# EAGLE design busadapt (EAGLE 6.6.0)
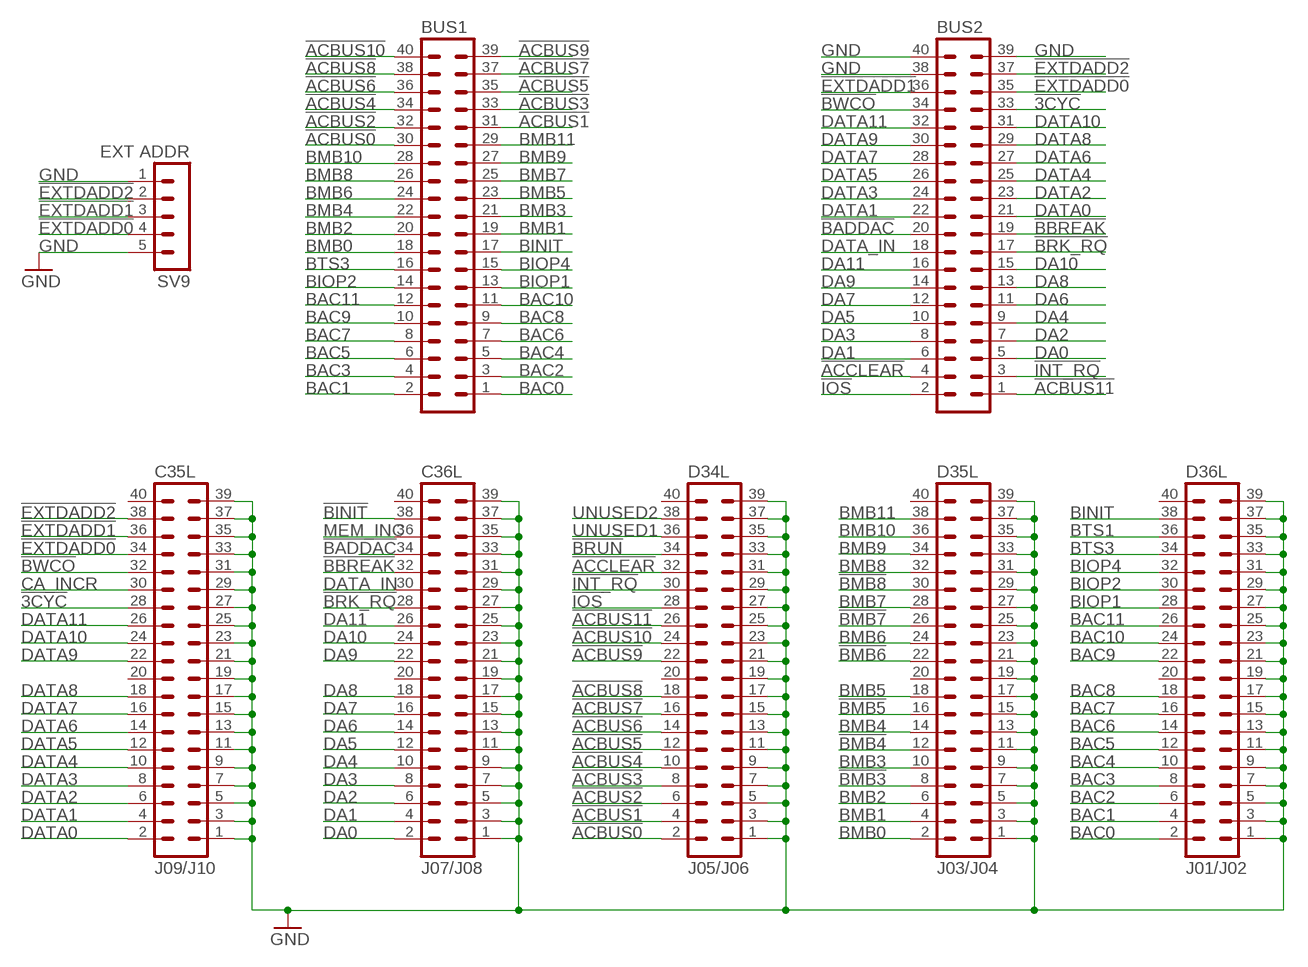
[diagram p0: schematic, sheet 1]

## Parts
BUS1  MA20-2  [MA20-2]
BUS2  MA20-2  [MA20-2]
C35L  J09/J10  MA20-2  [MA20-2]
C36L  J07/J08  MA20-2  [MA20-2]
D34L  J05/J06  MA20-2  [MA20-2]
D35L  J03/J04  MA20-2  [MA20-2]
D36L  J01/J02  MA20-2  [MA20-2]
SV9  EXT ADDR  MA05-1  [MA05-1]

## Nets
!3CYC: BUS2.33 C35L.28
!ACBUS0: BUS1.30 D34L.2
!ACBUS1: BUS1.31 D34L.4
!ACBUS2: BUS1.32 D34L.6
!ACBUS3: BUS1.33 D34L.8
!ACBUS4: BUS1.34 D34L.10
!ACBUS5: BUS1.35 D34L.12
!ACBUS6: BUS1.36 D34L.14
!ACBUS7: BUS1.37 D34L.16
!ACBUS8: BUS1.38 D34L.18
!ACBUS9: BUS1.39 D34L.22
!ACBUS10: BUS1.40 D34L.24
!ACBUS11: BUS2.1 D34L.26
!ACCLEAR: BUS2.4 D34L.32
!BADDAC: BUS2.20 C36L.34
!BBREAK: BUS2.19 C36L.32
!BINIT: C36L.38
!BMB3: D35L.8
!BMB4: D35L.12
!BMB5: D35L.16
!BMB6: D35L.22
!BMB7: D35L.26
!BMB8: D35L.30
!BRK_RQ: BUS2.17 C36L.28
!BRUN: D34L.34
!BWCO: BUS2.34 C35L.32
!EXTDADD0: BUS2.35 C35L.34 SV9.4
!EXTDADD1: BUS2.36 C35L.36 SV9.3
!EXTDADD2: BUS2.37 C35L.38 SV9.2
!INT_RQ: BUS2.3 D34L.30
!IOS: BUS2.2 D34L.28
BAC0: BUS1.1 D36L.2
BAC1: BUS1.2 D36L.4
BAC2: BUS1.3 D36L.6
BAC3: BUS1.4 D36L.8
BAC4: BUS1.5 D36L.10
BAC5: BUS1.6 D36L.12
BAC6: BUS1.7 D36L.14
BAC7: BUS1.8 D36L.16
BAC8: BUS1.9 D36L.18
BAC9: BUS1.10 D36L.22
BAC10: BUS1.11 D36L.24
BAC11: BUS1.12 D36L.26
BINIT: BUS1.17 D36L.38
BIOP1: BUS1.13 D36L.28
BIOP2: BUS1.14 D36L.30
BIOP4: BUS1.15 D36L.32
BMB0: BUS1.18 D35L.2
BMB1: BUS1.19 D35L.4
BMB2: BUS1.20 D35L.6
BMB3: BUS1.21 D35L.10
BMB4: BUS1.22 D35L.14
BMB5: BUS1.23 D35L.18
BMB6: BUS1.24 D35L.24
BMB7: BUS1.25 D35L.28
BMB8: BUS1.26 D35L.32
BMB9: BUS1.27 D35L.34
BMB10: BUS1.28 D35L.36
BMB11: BUS1.29 D35L.38
BTS1: D36L.36
BTS3: BUS1.16 D36L.34
CA_INCR: C35L.30
DA0: BUS2.5 C36L.2
DA1: BUS2.6 C36L.4
DA2: BUS2.7 C36L.6
DA3: BUS2.8 C36L.8
DA4: BUS2.9 C36L.10
DA5: BUS2.10 C36L.12
DA6: BUS2.11 C36L.14
DA7: BUS2.12 C36L.16
DA8: BUS2.13 C36L.18
DA9: BUS2.14 C36L.22
DA10: BUS2.15 C36L.24
DA11: BUS2.16 C36L.26
DATA0: BUS2.21 C35L.2
DATA1: BUS2.22 C35L.4
DATA2: BUS2.23 C35L.6
DATA3: BUS2.24 C35L.8
DATA4: BUS2.25 C35L.10
DATA5: BUS2.26 C35L.12
DATA6: BUS2.27 C35L.14
DATA7: BUS2.28 C35L.16
DATA8: BUS2.29 C35L.18
DATA9: BUS2.30 C35L.22
DATA10: BUS2.31 C35L.24
DATA11: BUS2.32 C35L.26
DATA_IN: BUS2.18 C36L.30
GND: BUS2.38 BUS2.39 BUS2.40 C35L.1 C35L.3 C35L.5 C35L.7 C35L.9 C35L.11 C35L.13 C35L.15 C35L.17 C35L.19 C35L.21 C35L.23 C35L.25 C35L.27 C35L.29 C35L.31 C35L.33 C35L.35 C35L.37 C35L.39 C36L.1 C36L.3 C36L.5 C36L.7 C36L.9 C36L.11 C36L.13 C36L.15 C36L.17 C36L.19 C36L.21 C36L.23 C36L.25 C36L.27 C36L.29 C36L.31 C36L.33 C36L.35 C36L.37 C36L.39 D34L.1 D34L.3 D34L.5 D34L.7 D34L.9 D34L.11 D34L.13 D34L.15 D34L.17 D34L.19 D34L.21 D34L.23 D34L.25 D34L.27 D34L.29 D34L.31 D34L.33 D34L.35 D34L.37 D34L.39 D35L.1 D35L.3 D35L.5 D35L.7 D35L.9 D35L.11 D35L.13 D35L.15 D35L.17 D35L.19 D35L.21 D35L.23 D35L.25 D35L.27 D35L.29 D35L.31 D35L.33 D35L.35 D35L.37 D35L.39 D36L.1 D36L.3 D36L.5 D36L.7 D36L.9 D36L.11 D36L.13 D36L.15 D36L.17 D36L.19 D36L.21 D36L.23 D36L.25 D36L.27 D36L.29 D36L.31 D36L.33 D36L.35 D36L.37 D36L.39 SV9.1 SV9.5
MEM_INC: C36L.36
UNUSED1: D34L.36
UNUSED2: D34L.38
Unconnected: C35L.20 C35L.40 C36L.20 C36L.40 D34L.20 D34L.40 D35L.20 D35L.40 D36L.20 D36L.40

## Library data of the parts
BUS1 BUS2 C35L C36L D34L D35L D36L = con-lstb:MA20-2: PIN HEADER; OC_FARNELL: unknown; OC_NEWARK: unknown
SV9 = con-lstb:MA05-1: PIN HEADER; OC_FARNELL: unknown; OC_NEWARK: unknown

## Board
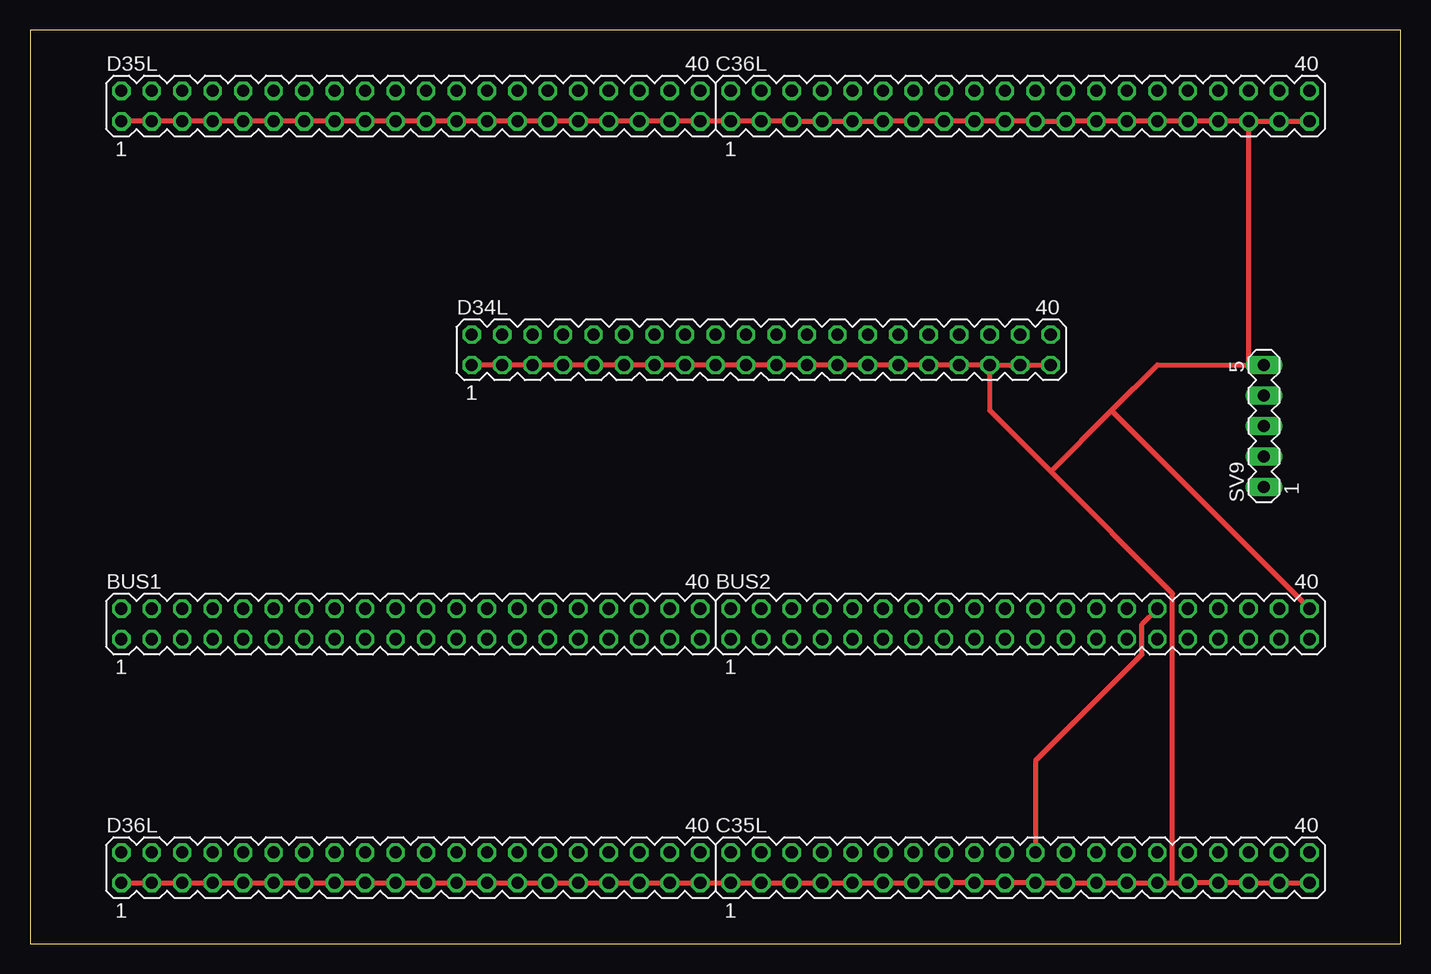
[diagram p1: board, top side]
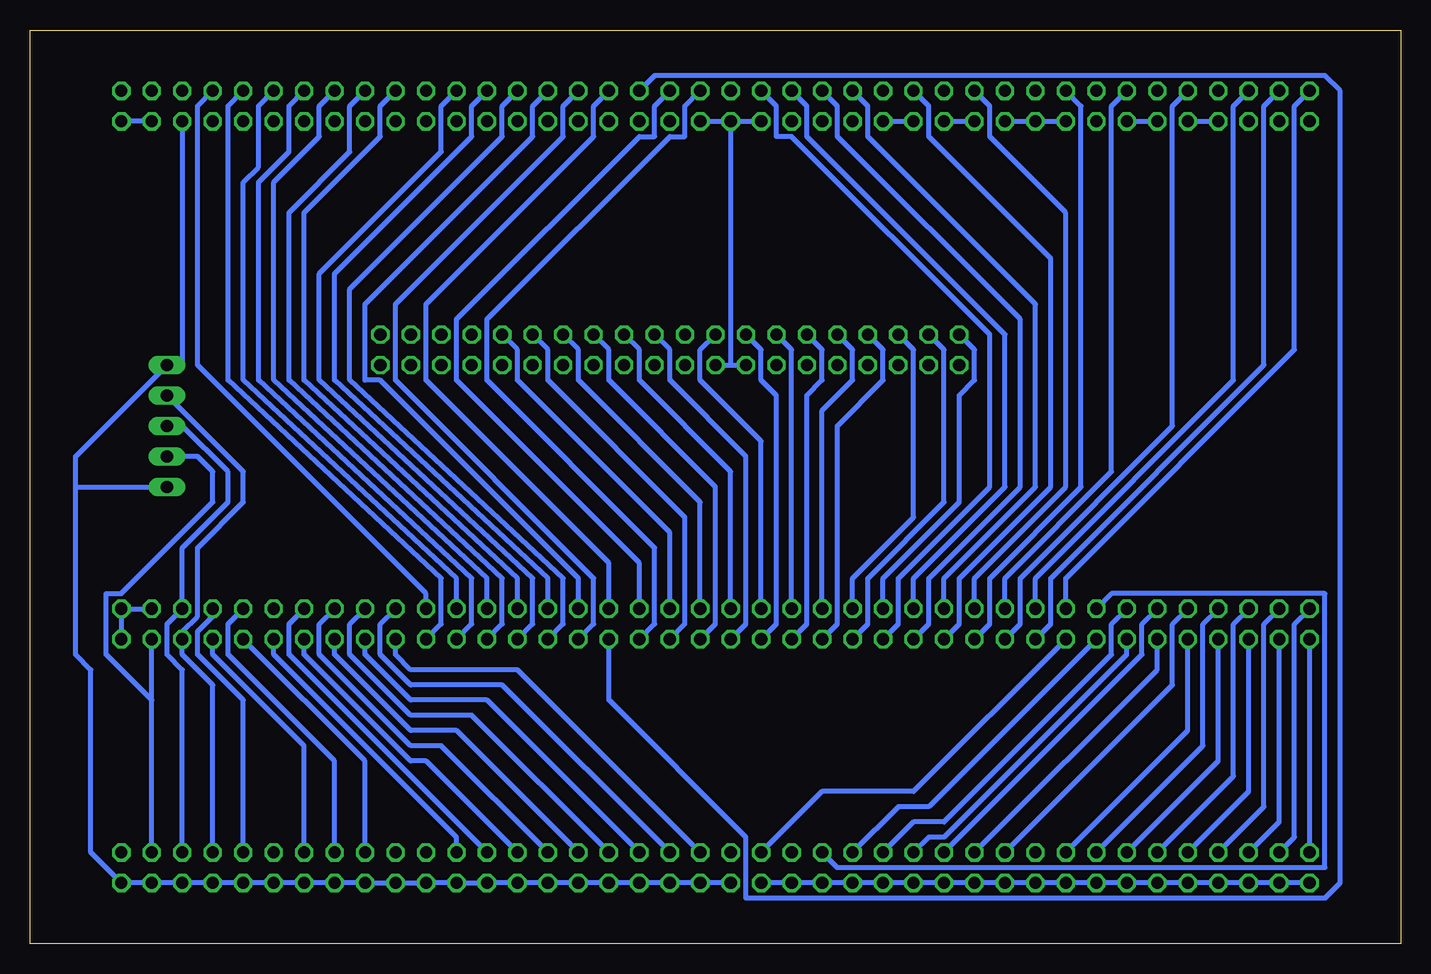
[diagram p2: board, bottom side, seen from below]

Size 114.29 x 76.19 mm. Coordinates in mm from the lower left corner, seen from the top.
Outline: 0,0 114.29,0 114.29,76.19 0,76.19 0,0
Copper layers (1+16): Top 0.035mm / dielectric 1.5mm / Bottom 0.035mm
Design rules "16mils": minimum track width 16mil, minimum drill 32mil, track to track 15mil, track to pad 10mil, pad to pad 10mil, via to via 10mil, smd to smd 10mil, copper to edge 13mil, drill to drill 10mil, minimum pad ring 10mil, minimum via ring 8mil, stop-mask expansion 0mil, vias tented up to drill 0mil, thermal gap 10mil

### Footprints (pad centres in the part's own frame; a part is rotated, then mirrored left to right if it is on the bottom)
MA20-2 = drill 1.016 octagon: 1 -24.13,-1.27; 2 -24.13,1.27; 3 -21.59,-1.27; 4 -21.59,1.27; 5 -19.05,-1.27; 6 -19.05,1.27; 7 -16.51,-1.27; 8 -16.51,1.27; 9 -13.97,-1.27; 10 -13.97,1.27; 11 -11.43,-1.27; 12 -11.43,1.27; 13 -8.89,-1.27; 14 -8.89,1.27; 15 -6.35,-1.27; 16 -6.35,1.27; 17 -3.81,-1.27; 18 -3.81,1.27; 19 -1.27,-1.27; 20 -1.27,1.27; 21 1.27,-1.27; 22 1.27,1.27; 23 3.81,-1.27; 24 3.81,1.27; 25 6.35,-1.27; 26 6.35,1.27; 27 8.89,-1.27; 28 8.89,1.27; 29 11.43,-1.27; 30 11.43,1.27; 31 13.97,-1.27; 32 13.97,1.27; 33 16.51,-1.27; 34 16.51,1.27; 35 19.05,-1.27; 36 19.05,1.27; 37 21.59,-1.27; 38 21.59,1.27; 39 24.13,-1.27; 40 24.13,1.27
MA05-1 = drill 1.016 long: 1 -5.08,0; 2 -2.54,0; 3 0,0; 4 2.54,0; 5 5.08,0

### Placement (x,y rotation side)
BUS1  31.74,26.67 0 top
BUS2  82.54,26.67 0 top
C35L  82.54,6.34 0 top
C36L  82.54,69.84 0 top
D34L  60.95,49.52 0 top
D35L  31.74,69.84 0 top
D36L  31.74,6.34 0 top
SV9  102.86,43.17 90 top

### Tracks (layer width: path | path; a pad name or v marks a point on that pad's centre or on a via)
!3CYC
  Bottom 0.406: C35L.28 91.43,16.51 99.05,24.12 BUS2.33
!ACBUS0
  Bottom 0.406: BUS1.30 43.17,30.48 36.82,36.82 36.82,45.71 35.55,46.98 35.55,49.52 D34L.2
!ACBUS1
  Bottom 0.406: BUS1.31 44.44,26.67 44.44,30.48 38.09,36.82 38.09,49.52 D34L.4
!ACBUS2
  Bottom 0.406: BUS1.32 45.71,30.48 40.63,35.55 40.63,49.52 D34L.6
!ACBUS3
  Bottom 0.406: BUS1.33 46.98,26.67 46.98,43.17 43.17,46.98 43.17,49.52 D34L.8
!ACBUS4
  Bottom 0.406: BUS1.34 48.25,44.45 45.71,46.98 45.71,49.52 D34L.10
!ACBUS5
  Bottom 0.406: BUS1.35 49.52,26.67 49.52,45.71 48.25,46.98 48.25,49.52 D34L.12
!ACBUS6
  Bottom 0.406: BUS1.36 50.79,49.52 D34L.14
!ACBUS7
  Bottom 0.406: BUS1.37 52.06,26.67 52.06,45.71 53.33,46.98 53.33,49.52 D34L.16
!ACBUS8
  Bottom 0.406: BUS1.38 53.33,41.9 58.41,46.98 58.41,49.52 D34L.18
!ACBUS9
  Bottom 0.406: BUS1.39 54.6,26.67 54.6,40.63 60.95,46.98 60.95,49.52 D34L.22
!ACBUS10
  Bottom 0.406: BUS1.40 55.87,39.36 63.49,46.98 63.49,49.52 D34L.24
!ACBUS11
  Bottom 0.406: BUS2.1 57.14,26.67 57.14,38.09 66.03,46.98 66.03,49.52 D34L.26
!ACCLEAR
  Bottom 0.406: BUS2.4 60.95,34.28 73.65,46.98 73.65,49.52 D34L.32
!BADDAC
  Bottom 0.406: C36L.34 100.32,69.84 100.32,48.25 81.27,29.21 BUS2.20
!BBREAK
  Bottom 0.406: BUS2.19 80,26.67 80,30.48 97.78,46.98 97.78,69.84 C36L.32
!BRK_RQ
  Bottom 0.406: BUS2.17 77.46,26.67 77.46,30.48 95.24,46.98 95.24,63.49 92.7,66.04 92.7,69.84 C36L.28
!BWCO
  Bottom 0.406: C35L.32 96.51,20.32 100.32,24.12 100.32,26.03 99.05,27.3 | 99.05,27.3 | 99.05,27.3 BUS2.34
!EXTDADD0
  Bottom 0.406: C35L.34 99.05,21.59 101.59,24.12 BUS2.35 101.59,26.03 100.32,27.3 100.32,33.02 96.51,36.82 96.51,39.36 SV9.4
!EXTDADD1
  Bottom 0.406: C35L.36 101.59,22.86 102.86,24.12 102.86,26.67 BUS2.36 101.59,33.02 99.05,35.55 97.78,36.82 97.78,39.36 101.59,43.17 SV9.3
!EXTDADD2
  Bottom 0.406: 104.13,20.32 BUS2.37 | C35L.38 104.13,20.32 | 104.13,20.32 107.94,24.12 107.94,29.21 106.67,29.21 99.05,36.82 99.05,39.36 100.32,40.63 SV9.2
!INT_RQ
  Bottom 0.406: BUS2.3 59.68,26.67 59.68,35.55 71.11,46.98 71.11,49.52 D34L.30
!IOS
  Bottom 0.406: BUS2.2 58.41,36.82 68.57,46.98 68.57,49.52 D34L.28
BAC0
  Bottom 0.406: D36L.2 BUS1.1
BAC1
  Bottom 0.406: D36L.4 8.88,8.88 8.88,26.67 BUS1.2
BAC2
  Bottom 0.406: D36L.6 10.15,10.15 BUS1.3
BAC3
  Bottom 0.406: BUS1.4 11.42,26.67 11.42,11.42 D36L.8
BAC4
  Bottom 0.406: D36L.10 12.69,12.69 BUS1.5
BAC5
  Bottom 0.406: D36L.12 13.96,13.96 13.96,26.67 BUS1.6
BAC6
  Bottom 0.406: BUS1.7 15.23,15.23 D36L.14
BAC7
  Bottom 0.406: BUS1.8 16.5,26.67 16.5,16.51 D36L.16
BAC8
  Bottom 0.406: BUS1.9 17.77,17.78 D36L.18
BAC9
  Bottom 0.406: D36L.22 19.04,21.59 19.04,26.67 BUS1.10
BAC10
  Bottom 0.406: D36L.24 20.31,22.86 BUS1.11
BAC11
  Bottom 0.406: D36L.26 21.58,24.12 21.58,26.67 BUS1.12
BINIT
  Bottom 0.406: BUS1.17 40.63,12.69 48.25,12.69 D36L.38
BIOP1
  Bottom 0.406: D36L.28 39.36,8.88 38.09,8.88 22.85,24.12 BUS1.13
BIOP2
  Bottom 0.406: BUS1.14 24.12,26.67 24.12,24.12 38.09,10.15 40.63,10.15 D36L.30
BIOP4
  Bottom 0.406: BUS1.15 39.36,11.42 41.9,11.42 D36L.32
BMB0
  Bottom 0.406: BUS1.18 27.93,30.48 8.88,49.52 8.88,69.84 D35L.2
BMB1
  Bottom 0.406: BUS1.19 29.2,26.67 29.2,30.48 11.42,48.25 11.42,69.84 D35L.4
BMB2
  Bottom 0.406: BUS1.20 30.47,30.48 13.96,46.98 13.96,69.84 D35L.6
BMB3
  Bottom 0.406: BUS1.21 31.74,26.67 31.74,30.48 19.04,43.17 19.04,69.84 D35L.10
BMB4
  Bottom 0.406: BUS1.22 33.01,30.48 24.12,39.36 24.12,69.84 D35L.14
BMB5
  Bottom 0.406: BUS1.23 34.28,26.67 34.28,30.48 26.66,38.09 26.66,69.84 D35L.18
BMB6
  Bottom 0.406: BUS1.24 35.55,30.48 27.93,38.09 27.93,60.95 34.28,67.31 34.28,69.84 D35L.24
BMB7
  Bottom 0.406: BUS1.25 36.82,26.67 36.82,30.48 29.2,38.09 29.2,57.14 39.36,67.31 39.36,69.84 D35L.28
BMB8
  Bottom 0.406: BUS1.26 38.09,30.48 30.47,38.09 30.47,53.34 44.44,67.31 44.44,69.84 D35L.32
BMB9
  Bottom 0.406: BUS1.27 39.36,26.67 39.36,30.48 31.74,38.09 31.74,52.06 46.98,67.31 46.98,69.84 D35L.34
BMB10
  Bottom 0.406: BUS1.28 40.63,30.48 33.01,38.09 33.01,50.79 49.52,67.31 49.52,69.84 D35L.36
BMB11
  Bottom 0.406: BUS1.29 41.9,26.67 41.9,30.48 34.28,38.09 34.28,50.79 50.79,67.31 52.06,67.31 52.06,69.84 D35L.38
BTS3
  Bottom 0.406: BUS1.16 24.12,29.21 6.34,29.21 6.34,6.34 46.98,6.34 D36L.34
DA0
  Bottom 0.406: BUS2.5 62.22,26.67 62.22,33.02 76.19,46.98 76.19,52.06 60.95,67.31 59.68,67.31 59.68,69.84 C36L.2
DA1
  Bottom 0.406: BUS2.6 63.49,31.75 78.73,46.98 78.73,52.06 63.49,67.31 62.22,67.31 62.22,69.84 C36L.4
DA2
  Bottom 0.406: BUS2.7 66.03,20.32 54.6,8.88 54.6,3.81 6.34,3.81 5.07,5.08 5.07,71.12 6.34,72.39 62.22,72.39 C36L.6
DA3
  Bottom 0.406: BUS2.8 66.03,31.75 81.27,46.98 81.27,53.34 67.3,67.31 67.3,69.84 C36L.8
DA4
  Bottom 0.406: BUS2.9 67.3,26.67 67.3,30.48 83.81,46.98 83.81,53.34 69.84,67.31 69.84,69.84 C36L.10
DA5
  Bottom 0.406: C36L.12 72.38,69.84 72.38,67.31 86.35,53.34 86.35,46.98 85.08,46.98 68.57,30.48 BUS2.10
DA6
  Bottom 0.406: BUS2.11 69.84,26.67 69.84,30.48 87.62,46.98 87.62,54.6 74.92,67.31 74.92,69.84 C36L.14
DA7
  Bottom 0.406: BUS2.12 71.11,30.48 88.89,46.98 88.89,55.88 77.46,67.31 77.46,69.84 C36L.16
DA8
  Bottom 0.406: BUS2.13 72.38,26.67 72.38,30.48 90.16,46.98 90.16,55.88 80,66.04 80,69.84 C36L.18
DA9
  Bottom 0.406: BUS2.14 73.65,30.48 91.43,46.98 91.43,60.95 85.08,67.31 85.08,69.84 C36L.22
DA10
  Bottom 0.406: BUS2.15 74.92,26.67 74.92,30.48 92.7,46.98 92.7,60.95 87.62,66.04 87.62,69.84 C36L.24
DA11
  Bottom 0.406: BUS2.16 76.19,30.48 93.97,46.98 93.97,63.49 90.16,67.31 90.16,69.84 C36L.26
DATA0
  Bottom 0.406: C35L.2 73.65,22.86 82.54,22.86 83.81,24.12 BUS2.21
DATA1
  Bottom 0.406: C35L.4 74.92,21.59 82.54,21.59 85.08,24.12 85.08,26.67 BUS2.22
DATA2
  Bottom 0.406: C35L.6 76.19,20.32 82.54,20.32 86.35,24.12 BUS2.23
DATA3
  Bottom 0.406: C35L.8 77.46,19.05 82.54,19.05 87.62,24.12 87.62,26.67 BUS2.24
DATA4
  Bottom 0.406: C35L.10 78.73,17.78 82.54,17.78 88.89,24.12 BUS2.25
DATA5
  Bottom 0.406: C35L.12 80,16.51 82.54,16.51 90.16,24.12 90.16,26.67 BUS2.26
DATA6
  Bottom 0.406: C35L.14 81.27,15.23 82.54,15.23 91.43,24.12 BUS2.27
DATA7
  Bottom 0.406: C35L.16 92.7,24.12 92.7,26.67 BUS2.28
DATA8
  Bottom 0.406: C35L.18 78.73,8.88 93.97,24.12 BUS2.29
DATA9
  Top 0.406: 92.7,26.67 92.7,24.12 83.81,15.23 C35L.22 | 92.7,26.67 | 92.7,26.67 BUS2.30 | C35L.22
DATA10
  Bottom 0.406: C35L.24 86.35,15.23 BUS2.31
DATA11
  Bottom 0.406: C35L.26 88.89,15.23 97.78,24.12 97.78,26.67 BUS2.32
DATA_IN
  Bottom 0.406: BUS2.18 78.73,30.48 96.51,46.98 96.51,63.49 95.24,64.77 95.24,69.84 C36L.30
GND
  Top 0.406: D36L.1 D36L.3 D36L.5 D36L.7 D36L.9 D36L.11 D36L.13 D36L.15 D36L.17 D36L.19 D36L.21 D36L.23 D36L.25 D36L.27 D36L.29 D36L.31 D36L.33 D36L.35 D36L.37 D36L.39 C35L.1 C35L.3 C35L.5 C35L.7 C35L.9 C35L.11 C35L.13 C35L.15 C35L.17 C35L.19 C35L.21 C35L.23 C35L.25 C35L.27 C35L.29 95.24,5.08 | 95.24,5.08 C35L.31 C35L.33 C35L.35 C35L.37 C35L.39 | D34L.1 D34L.3 D34L.5 D34L.7 D34L.9 D34L.11 D34L.13 D34L.15 D34L.17 D34L.19 D34L.21 D34L.23 D34L.25 D34L.27 D34L.29 D34L.31 D34L.33 D34L.35 | D34L.35 80,44.45 85.08,39.36 | D34L.35 D34L.37 D34L.39 | 85.08,39.36 95.24,29.21 95.24,5.08 | 85.08,39.36 90.16,44.45 | 90.16,44.45 93.97,48.25 101.59,48.25 | 90.16,44.45 BUS2.40 | D35L.1 D35L.3 D35L.5 D35L.7 D35L.9 D35L.11 D35L.13 D35L.15 D35L.17 D35L.19 D35L.21 D35L.23 D35L.25 D35L.27 D35L.29 D35L.31 D35L.33 D35L.35 D35L.37 D35L.39 C36L.1 C36L.3 C36L.5 C36L.7 C36L.9 C36L.11 C36L.13 C36L.15 C36L.17 C36L.19 C36L.21 C36L.23 C36L.25 C36L.27 C36L.29 C36L.31 C36L.33 C36L.35 | C36L.35 C36L.37 C36L.39 | 101.59,48.25 101.59,49.52 C36L.35 | 101.59,48.25 SV9.5
  Bottom 0.406: D36L.37 D36L.35 D36L.33 D36L.31 D36L.29 D36L.27 D36L.25 D36L.23 D36L.21 D36L.19 D36L.17 D36L.15 D36L.13 D36L.11 D36L.9 D36L.7 D36L.5 D36L.3 D36L.1 | D35L.9 D35L.7 | D36L.39 C35L.1 C35L.3 C35L.5 C35L.7 C35L.9 C35L.11 C35L.13 C35L.15 C35L.17 C35L.19 C35L.21 C35L.23 C35L.25 C35L.27 C35L.29 C35L.31 C35L.33 C35L.35 C35L.37 C35L.39 109.21,7.62 109.21,22.86 110.48,24.12 110.48,38.09 | C36L.37 C36L.39 | C36L.35 101.59,48.25 SV9.5 110.48,40.63 110.48,38.09 | D35L.13 D35L.11 | D35L.17 D35L.19 D35L.21 | D35L.25 D35L.23 | D34L.17 55.87,48.25 | 55.87,48.25 D34L.15 | D35L.39 D35L.37 | C36L.1 D35L.39 | D35L.39 55.87,48.25 | D35L.29 D35L.27 | BUS2.39 BUS2.40 BUS2.38 | 110.48,38.09 SV9.1